# EAGLE design jamma (EAGLE 7.3.0)
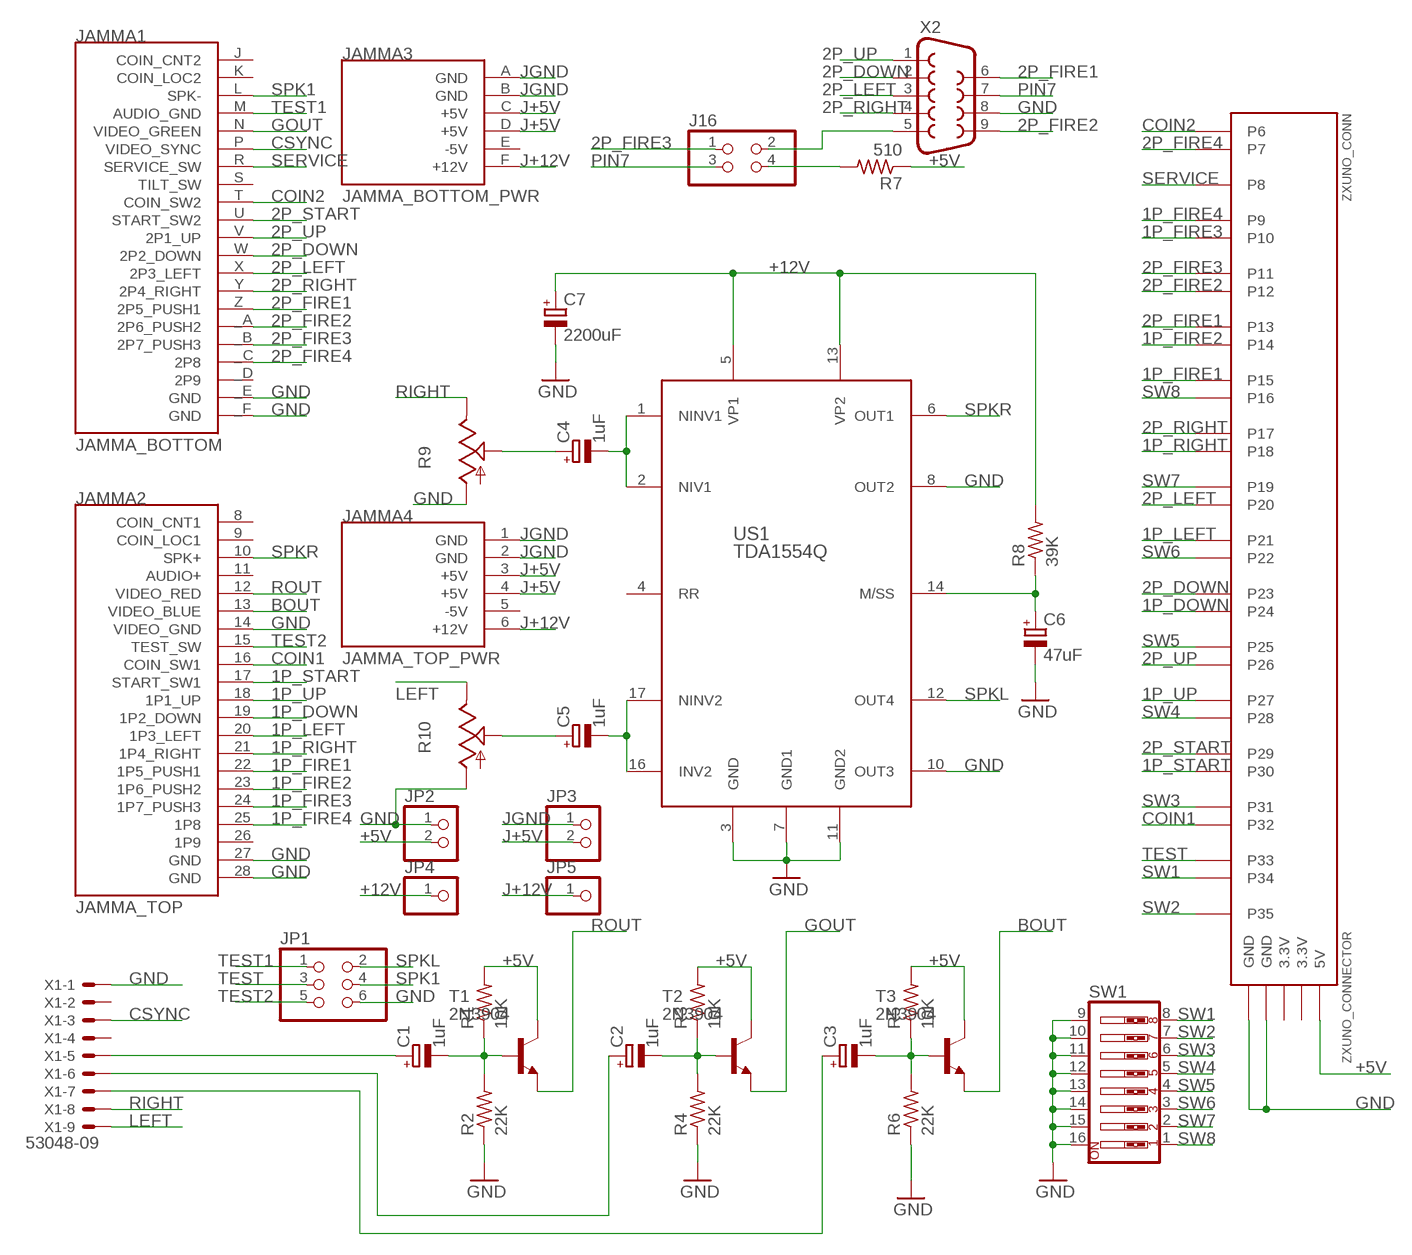
[diagram p0: schematic, sheet 1]

## Parts
C1  1uF  CPOL-EUE2-5  [E2-5]
C2  1uF  CPOL-EUE2-5  [E2-5]
C3  1uF  CPOL-EUE2-5  [E2-5]
C4  1uF  CPOL-EUE2-5  [E2-5]
C5  1uF  CPOL-EUE2-5  [E2-5]
C6  47uF  CPOL-EUE5-5  [E5-5]
C7  2200uF  CPOL-EUE5-10.5  [E5-10,5]
J16  PINHD-2X2  [2X02]
JAMMA1  JAMMA_BOTTOM  [JAMMA_BOTTOM]
JAMMA2  JAMMA_TOP  [JAMMA_TOP]
JAMMA3  JAMMA_BOTTOM_PWR  [JAMMA_BOTTOM_PWR]
JAMMA4  JAMMA_TOP_PWR  [JAMMA_TOP_PWR]
JP1  PINHD-2X3/90  [2X03/90]
JP2  PINHD-1X2  [1X02]
JP3  PINHD-1X2  [1X02]
JP4  PINHD-1X1  [1X01]
JP5  PINHD-1X1  [1X01]
R1  10K  R-US_0204/7  [0204/7]
R2  22K  R-US_0204/7  [0204/7]
R3  10K  R-US_0204/7  [0204/7]
R4  22K  R-US_0204/7  [0204/7]
R5  10K  R-US_0204/7  [0204/7]
R6  22K  R-US_0204/7  [0204/7]
R7  510  R-US_0204/7  [0204/7]
R8  39K  R-US_0204/7  [0204/7]
R9  TRIM_US-CA6V  [CA6V]
R10  TRIM_US-CA6V  [CA6V]
SW1  SW_DIP-8  [EDG-08]
T1  2N3904  [TO92]
T2  2N3904  [TO92]
T3  2N3904  [TO92]
US1  TDA1554Q  [SOT243-1]
X1  53048-09  [53048-09]
X2  DB9MALE  [DB9_MALE]
ZXUNO_CONN  ZXUNO_CONNECTOR  [ZXUNO_CONNECTOR]

## Nets
1P_DOWN: JAMMA2.19(1P2_DOWN) ZXUNO_CONN.P24
1P_FIRE1: JAMMA2.22(1P5_PUSH1) ZXUNO_CONN.P15
1P_FIRE2: JAMMA2.23(1P6_PUSH2) ZXUNO_CONN.P14
1P_FIRE3: JAMMA2.24(1P7_PUSH3) ZXUNO_CONN.P10
1P_FIRE4: JAMMA2.25(1P8) ZXUNO_CONN.P9
1P_LEFT: JAMMA2.20(1P3_LEFT) ZXUNO_CONN.P21
1P_RIGHT: JAMMA2.21(1P4_RIGHT) ZXUNO_CONN.P18
1P_START: JAMMA2.17(START_SW1) ZXUNO_CONN.P30
1P_UP: JAMMA2.18(1P1_UP) ZXUNO_CONN.P27
2P_DOWN: JAMMA1.W(2P2_DOWN) X2.2 ZXUNO_CONN.P23
2P_FIRE1: JAMMA1.Z(2P5_PUSH1) X2.6 ZXUNO_CONN.P13
2P_FIRE2: JAMMA1._A(2P6_PUSH2) X2.9 ZXUNO_CONN.P12
2P_FIRE3: J16.1 JAMMA1._B(2P7_PUSH3) ZXUNO_CONN.P11
2P_FIRE4: JAMMA1._C(2P8) ZXUNO_CONN.P7
2P_LEFT: JAMMA1.X(2P3_LEFT) X2.3 ZXUNO_CONN.P20
2P_RIGHT: JAMMA1.Y(2P4_RIGHT) X2.4 ZXUNO_CONN.P17
2P_START: JAMMA1.U(START_SW2) ZXUNO_CONN.P29
2P_UP: JAMMA1.V(2P1_UP) X2.1 ZXUNO_CONN.P26
+5V [power]: JP2.2 R1.2 R3.2 R5.2 R7.1 T1.1(C) T2.1(C) T3.1(C) ZXUNO_CONN.5V
+12V: C7.+ JP4.1 R8.2 US1.5(VP1) US1.13(VP2)
BIN: C3.+ X1.3
BOUT: JAMMA2.13(VIDEO_BLUE) T3.3(E)
COIN1: JAMMA2.16(COIN_SW1) ZXUNO_CONN.P32
COIN2: JAMMA1.T(COIN_SW2) ZXUNO_CONN.P6
CSYNC: JAMMA1.P(VIDEO_SYNC) X1.7
GIN: C2.+ X1.4
GND [power]: C6.- C7.- JAMMA1._E(GND) JAMMA1._F(GND) JAMMA2.14(VIDEO_GND) JAMMA2.27(GND) JAMMA2.28(GND) JP1.6 JP2.1 R2.1 R4.1 R6.1 R9.A R10.A SW1.9 SW1.10 SW1.11 SW1.12 SW1.13 SW1.14 SW1.15 SW1.16 US1.3(GND) US1.7(GND1) US1.8(OUT2) US1.10(OUT3) US1.11(GND2) X1.9 X2.8 ZXUNO_CONN.GND@1(GND) ZXUNO_CONN.GND@2(GND)
GOUT: JAMMA1.N(VIDEO_GREEN) T2.3(E)
J+5V [power]: JAMMA3.C(+5V) JAMMA3.D(+5V) JAMMA4.3(+5V) JAMMA4.4(+5V) JP3.2
J+12V: JAMMA3.F(+12V) JAMMA4.6(+12V) JP5.1
JGND [power]: JAMMA3.A(GND) JAMMA3.B(GND) JAMMA4.1(GND) JAMMA4.2(GND) JP3.1
LEFT: R10.E X1.1
N$1: C4.- US1.1(NINV1) US1.2(NIV1)
N$2: C5.- US1.16(INV2) US1.17(NINV2)
N$3: C5.+ R10.S
N$4: C1.- R1.1 R2.2 T1.2(B)
N$5: J16.2 X2.5
N$7: C6.+ R8.1 US1.14(M/SS)
N$8: C3.- R5.1 R6.2 T3.2(B)
N$9: C4.+ R9.S
N$11: C2.- R3.1 R4.2 T2.2(B)
N$15: J16.4 R7.2
PIN7: J16.3 X2.7
RIGHT: R9.E X1.2
RIN: C1.+ X1.5
ROUT: JAMMA2.12(VIDEO_RED) T1.3(E)
SERVICE: JAMMA1.R(SERVICE_SW) ZXUNO_CONN.P8
SPK1: JAMMA1.L(SPK-) JP1.4
SPKL: JP1.2 US1.12(OUT4)
SPKR: JAMMA2.10(SPK+) US1.6(OUT1)
SW1: SW1.8 ZXUNO_CONN.P34
SW2: SW1.7 ZXUNO_CONN.P35
SW3: SW1.6 ZXUNO_CONN.P31
SW4: SW1.5 ZXUNO_CONN.P28
SW5: SW1.4 ZXUNO_CONN.P25
SW6: SW1.3 ZXUNO_CONN.P22
SW7: SW1.2 ZXUNO_CONN.P19
SW8: SW1.1 ZXUNO_CONN.P16
TEST: JP1.3 ZXUNO_CONN.P33
TEST1: JAMMA1.M(AUDIO_GND) JP1.1
TEST2: JAMMA2.15(TEST_SW) JP1.5
Unconnected: JAMMA1._D(2P9) JAMMA1.J(COIN_CNT2) JAMMA1.K(COIN_LOC2) JAMMA1.S(TILT_SW) JAMMA2.8(COIN_CNT1) JAMMA2.9(COIN_LOC1) JAMMA2.11(AUDIO+) JAMMA2.26(1P9) US1.4(RR) X1.6 X1.8

## Power pins joined to a net without a drawn wire
3.3V: ZXUNO_CONN.3.3V@1(3.3V) ZXUNO_CONN.3.3V@2(3.3V)
-5V: JAMMA3.E(-5V) JAMMA4.5(-5V)

## Library data of the parts
C1-C7 = rcl:CPOL-EU: POLARIZED CAPACITOR, European symbol
J16 = pinhead:PINHD-2X2: PIN HEADER
JAMMA1 = JAMMA:JAMMA_BOTTOM: JAMMA Connector Bottom Solder side for these card-edge connenctors HIROSE CR7E-56DA-3.96E HIROSE CR7E-56DB-3.96E KEL 1168-056-009
JAMMA2 = JAMMA:JAMMA_TOP: JAMMA Connector Top Parts side for these card-edge connenctors HIROSE CR7E-56DA-3.96E HIROSE CR7E-56DB-3.96E KEL 1168-056-009
JAMMA3 = JAMMA_pwr:JAMMA_BOTTOM_PWR: JAMMA Connector Bottom Solder side for these card-edge connenctors HIROSE CR7E-56DA-3.96E HIROSE CR7E-56DB-3.96E KEL 1168-056-009
JAMMA4 = JAMMA_pwr:JAMMA_TOP_PWR: JAMMA Connector Top Parts side for these card-edge connenctors HIROSE CR7E-56DA-3.96E HIROSE CR7E-56DB-3.96E KEL 1168-056-009
JP1 = pinhead:PINHD-2X3: PIN HEADER
JP2 JP3 = pinhead:PINHD-1X2: PIN HEADER
JP4 JP5 = pinhead:PINHD-1X1: PIN HEADER
R1-R6 = adafruit:R-US_: RESISTOR, American symbol
R7 R8 = rcl:R-US_: RESISTOR, American symbol
R9 R10 = pot:TRIM_US-: POTENTIOMETER
SW1 = special:SW_DIP-8: DIP SWITCH
T1-T3 = transistor:2N3904: NPN TRANSISTOR
US1 = PowerAmplifier:TDA1554: The TDA1554Q is an integrated class-B output amplifier in a 17-lead single-in-line (SIL) plastic power package. The circuit contains 4 x 11 W single-ended or 2 x 22 W bridge amplifiers. The device is primarily developed for car radio applications.
X1 = con-molex:53?-09: CONNECTOR wire to board 1.25 mm (.049 inch) pitch header; MPN: 53048-0910; OC_FARNELL: 1012239; OC_NEWARK: 98K9837
X2 = SparkFun-Connectors:DB9: DB9 Connector Standard DB9 (D-Sub 9) serial connector. Can be used for CAN bus as well as RS485 and RS232. Footprint production proven. Spark Fun Electronics SKU : PRT-00429
ZXUNO_CONN = zxuno:ZXUNO_CONNECTOR

## Net classes
1 power: width 0.305 mm, clearance 0.178 mm to class 0, clearance 0.229 mm

## Board
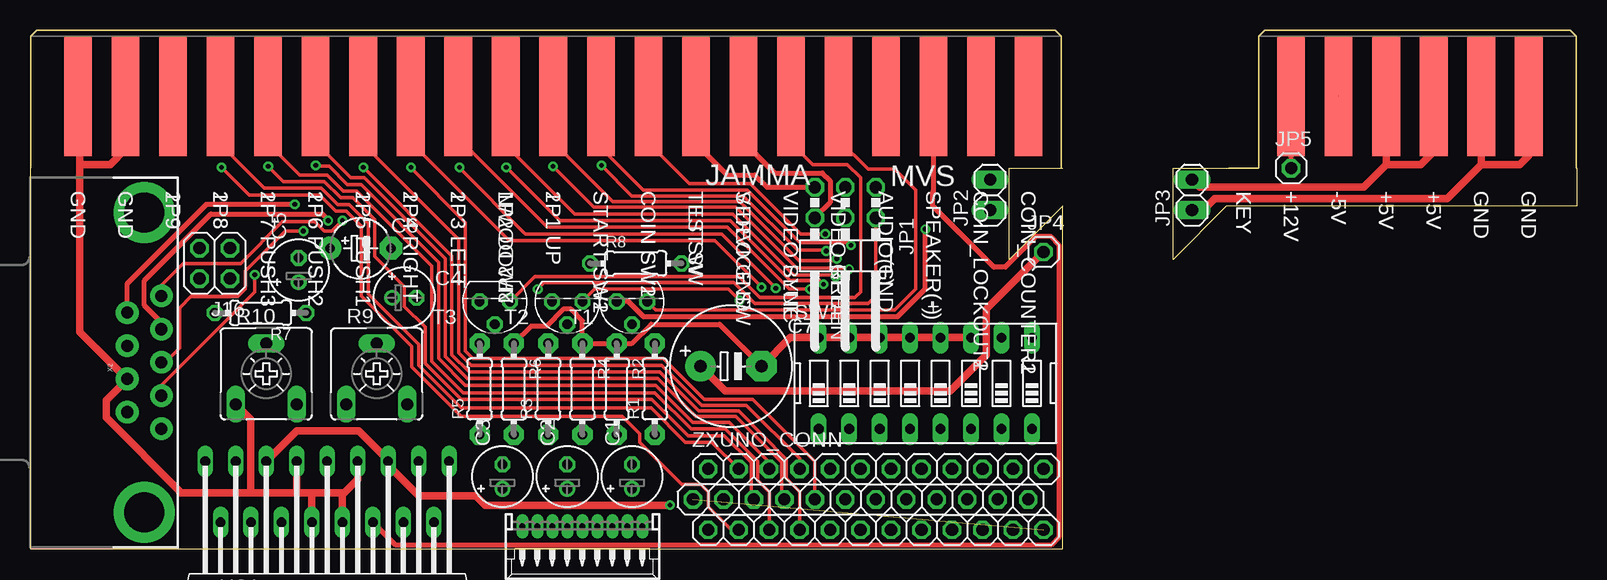
[diagram p1: board, top side]
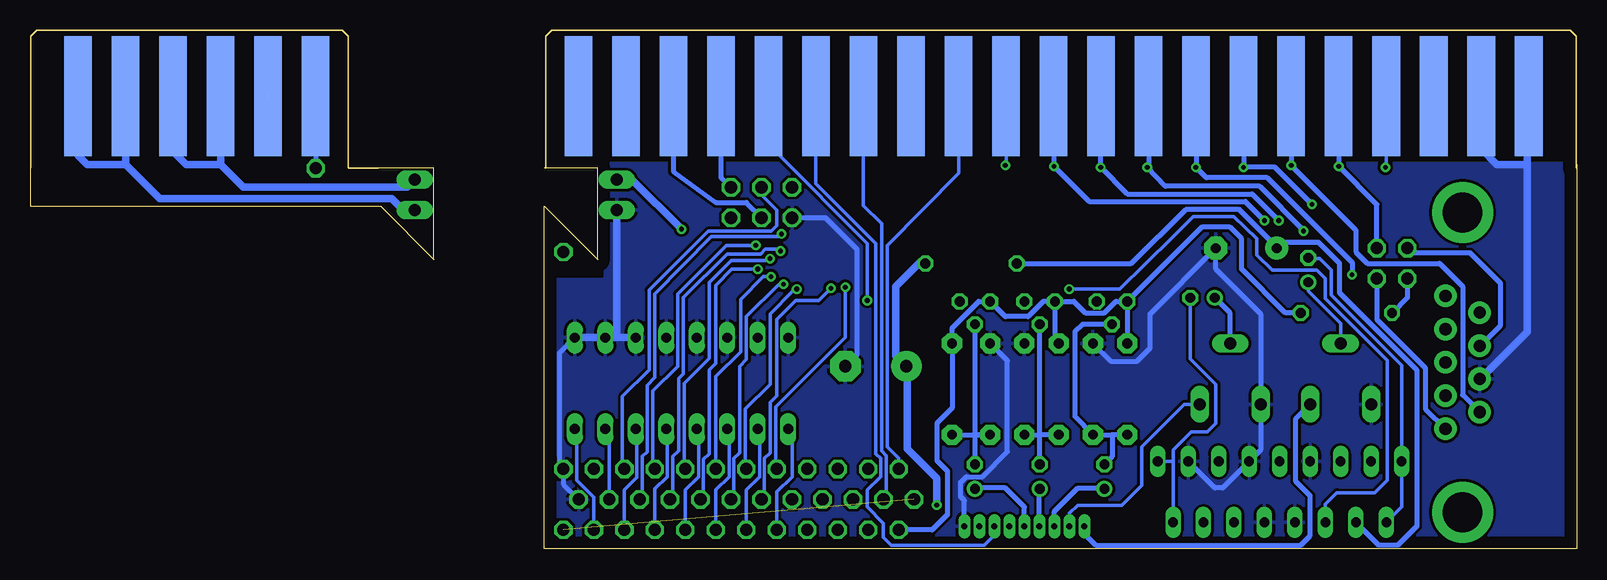
[diagram p2: board, bottom side, seen from below]

Size 128.91 x 43.28 mm. Coordinates in mm from the lower left corner, seen from the top.
Outline: 86.02,0 0,0 0,32.05
Outline: 86.04,0 86.04,28.57 81.6,24.13 81.6,31.75 86.04,31.75
Outline: 128.91,31.75 128.91,28.57 99.69,28.57 95.25,24.13 95.25,31.75 102.23,31.75
Copper layers (1*16): Top 0.035mm / dielectric 1.5mm / Bottom 0.035mm
Design rules "default": minimum track width 10mil, minimum drill 24mil, track to track 8mil, track to pad 8mil, pad to pad 8mil, via to via 8mil, smd to smd 8mil, copper to edge 40mil, drill to drill 8mil, minimum pad ring 10mil, minimum via ring 8mil, stop-mask expansion 4mil, vias tented up to drill 0mil, thermal gap 10mil

### Footprints (pad centres in the part's own frame; a part is rotated, then mirrored left to right if it is on the bottom)
E2-5 = drill 0.813 pad 1.27: + -1.016,0 | drill 0.813 pad 1.27 octagon: - 1.016,0
E5-5 = drill 0.813 pad 1.905: + -2.54,0 | drill 0.813 pad 1.905 octagon: - 2.54,0
E5-10,5 = drill 1.016 pad 2.54: + -2.54,0 | drill 1.016 pad 2.54 octagon: - 2.54,0
2X02 = drill 1.016 octagon: 1 -1.27,-1.27; 2 -1.27,1.27; 3 1.27,-1.27; 4 1.27,1.27
JAMMA_BOTTOM = smd 2.3 x 10 bottom: _A 33.66,0; _B 37.62,0; _C 41.58,0; _D 45.54,0; _E 49.5,0; _F 53.46,0; J -25.74,0; K -21.78,0; L -17.82,0; M -13.86,0; N -9.9,0; P -5.94,0; R -1.98,0; S 1.98,0; T 5.94,0; U 9.9,0; V 13.86,0; W 17.82,0; X 21.78,0; Y 25.74,0; Z 29.7,0
JAMMA_TOP = smd 2.3 x 10: 8 -25.74,0; 9 -21.78,0; 10 -17.82,0; 11 -13.86,0; 12 -9.9,0; 13 -5.94,0; 14 -1.98,0; 15 1.98,0; 16 5.94,0; 17 9.9,0; 18 13.86,0; 19 17.82,0; 20 21.78,0; 21 25.74,0; 22 29.7,0; 23 33.66,0; 24 37.62,0; 25 41.58,0; 26 45.54,0; 27 49.5,0; 28 53.46,0
JAMMA_BOTTOM_PWR = smd 2.3 x 10 bottom: A -10.28,0; B -6.32,0; C -2.36,0; D 1.6,0; E 5.56,0; F 9.52,0
JAMMA_TOP_PWR = smd 2.3 x 10: 1 -10.28,0; 2 -6.32,0; 3 -2.36,0; 4 1.6,0; 5 5.56,0; 6 9.52,0
2X03/90 = drill 1.016 octagon: 1 -2.54,-6.35; 2 -2.54,-3.81; 3 0,-6.35; 4 0,-3.81; 5 2.54,-6.35; 6 2.54,-3.81
1X02 = drill 1.016 long: 1 -1.27,0; 2 1.27,0
1X01 = drill 1.016 octagon: 1 0,0
0204/7 = drill 0.813 pad 1.676 octagon: 1 -3.81,0; 2 3.81,0
0204/7' = drill 0.813 octagon: 1 -3.81,0; 2 3.81,0
CA6V = drill 1.016 long: A -2.54,-2.54; E 2.54,-2.54; S 0,2.54
EDG-08 = drill 0.813 long: 1 -8.89,-3.81; 2 -6.35,-3.81; 3 -3.81,-3.81; 4 -1.27,-3.81; 5 1.27,-3.81; 6 3.81,-3.81; 7 6.35,-3.81; 8 8.89,-3.81; 9 8.89,3.81; 10 6.35,3.81; 11 3.81,3.81; 12 1.27,3.81; 13 -1.27,3.81; 14 -3.81,3.81; 15 -6.35,3.81; 16 -8.89,3.81
TO92 = drill 0.813 octagon: 1 1.27,0; 2 0,1.905; 3 -1.27,0
SOT243-1 = drill 0.8 long: 1 10.16,13.97; 2 8.89,8.89; 3 7.62,13.97; 4 6.35,8.89; 5 5.08,13.97; 6 3.81,8.89; 7 2.54,13.97; 8 1.27,8.89; 9 0,13.97; 10 -1.27,8.89; 11 -2.54,13.97; 12 -3.81,8.89; 13 -5.08,13.97; 14 -6.35,8.89; 15 -7.62,13.97; 16 -8.89,8.89; 17 -10.16,13.97
53048-09 = drill 0.5 pad 0.698 long: 1 5,-1.25; 2 3.75,-1.25; 3 2.5,-1.25; 4 1.25,-1.25; 5 0,-1.25; 6 -1.25,-1.25; 7 -2.5,-1.25; 8 -3.75,-1.25; 9 -5,-1.25
DB9_MALE = drill 1.016 pad 1.88: 1 5.54,-1.42; 2 2.77,-1.42; 3 0,-1.42; 4 -2.77,-1.42; 5 -5.54,-1.42; 6 4.15,1.42; 7 1.38,1.42; 8 -1.38,1.42; 9 -4.15,1.42 | drill 3.302 pad 5.08: G1 -12.5,0; G2 12.5,0
ZXUNO_CONNECTOR = drill 1.016 octagon: 3.3V@1 -13.97,0; 3.3V@2 15.24,-2.54; 5V -12.7,-2.54; GND@1 15.24,2.54; GND@2 13.97,0; NC@1 12.7,2.54; P6 -12.7,2.54; P7 -10.16,-2.54; P8 -11.43,0; P9 -10.16,2.54; P10 -7.62,-2.54; P11 -8.89,0; P12 -7.62,2.54; P13 -5.08,-2.54; P14 -6.35,0; P15 -5.08,2.54; P16 -2.54,-2.54; P17 -3.81,0; P18 -2.54,2.54; P19 0,-2.54; P20 -1.27,0; P21 0,2.54; P22 2.54,-2.54; P23 1.27,0; P24 2.54,2.54; P25 5.08,-2.54; P26 3.81,0; P27 5.08,2.54; P28 7.62,-2.54; P29 6.35,0; P30 7.62,2.54; P31 10.16,-2.54; P32 8.89,0; P33 10.16,2.54; P34 12.7,-2.54; P35 11.43,0

### Placement (x,y rotation side)
C1  50.16,6.03 90 top
C2  44.77,6.03 90 top
C3  39.37,6.03 90 top
C4  31.19,20.95 0 top
C5  22.38,23.26 90 top
C6  27.54,25.08 0 top
C7  58.42,15.24 0 top
J16  15.4,23.81 180 top
JAMMA1  57.47,37.78 180 top
JAMMA2  57.47,37.78 180 top
JAMMA3  114.62,37.78 180 top
JAMMA4  114.62,37.78 180 top
JP1  67.94,23.81 180 top
JP2  80.01,29.53 90 top
JP3  96.84,29.53 90 top
JP4  84.45,24.77 0 top
JP5  105.09,31.75 0 top
R1  52.07,13.34 90 top
R2  48.9,13.34 270 top
R3  43.18,13.34 90 top
R4  46.04,13.34 270 top
R5  37.47,13.34 90 top
R6  40.32,13.34 270 top
R7  510  [0204/7']  19.21,19.68 180 top
R8  39K  [0204/7']  50.48,23.81 0 top
R9  28.89,14.61 0 top
R10  19.68,14.61 0 top
SW1  74.61,13.81 0 top
T1  50.16,20.64 180 top
T2  44.77,20.64 180 top
T3  38.73,20.64 180 top
US1  24.77,-6.67 0 top
X1  46.04,0.64 180 top
X2  9.53,15.56 90 top
ZXUNO_CONN  69.22,4.13 0 top

### Tracks (layer width: path | path; a pad name or v marks a point on that pad's centre or on a via)
1P_DOWN  (via drill 0.4)
  Top 0.305: JAMMA2.19 39.65,33.7 45.4,27.94 58.58,27.94 63.66,22.86 66.99,22.86 v67.15,22.7
  Bottom 0.305: v67.15,22.7 67.79,22.7 69.69,20.8 69.69,16.43 71.75,14.37 ZXUNO_CONN.P24
1P_FIRE1
  Top 0.305: JAMMA2.22 27.77,33.75 35.72,25.8 35.72,16.35 36.75,15.32 52.63,15.32 55.96,11.99 59.69,11.99 64.14,7.54 ZXUNO_CONN.P15
1P_FIRE2
  Top 0.305: JAMMA2.23 23.81,33.9 26.75,30.96 27.86,30.96 34.61,24.21 34.61,16.03 36.43,14.21 52.31,14.21 55.48,11.03 58.82,11.03 62.63,7.22 62.63,4.37 ZXUNO_CONN.P14
1P_FIRE3
  Top 0.305: JAMMA2.24 19.85,33.81 22.46,31.19 24.77,31.19 26.11,29.84 27.23,29.84 33.5,23.57 33.5,15.64 36.12,13.02 52.07,13.02 55.09,10 57.94,10 60.64,7.3 60.64,5.71 61.59,4.76 ZXUNO_CONN.P10
1P_FIRE4
  Top 0.305: JAMMA2.25 15.89,33.72 19.53,30.08 24.29,30.08 25.64,28.73 26.59,28.73 28.18,27.15 28.18,21.27 32.38,17.07 32.38,15.32 35.96,11.75 51.75,11.75 54.61,8.89 56.83,8.89 ZXUNO_CONN.P9
1P_LEFT  (via drill 0.4)
  Top 0.305: JAMMA2.20 35.69,34.24 43.1,26.83 58.1,26.83 63.26,21.67 v65.01,21.67
  Bottom 0.305: v65.01,21.67 65.33,21.51 67.23,19.61 67.23,13.73 69.29,11.67 69.29,6.75 ZXUNO_CONN.P21
1P_RIGHT  (via drill 0.4)
  Top 0.305: JAMMA2.21 31.73,33.92 39.93,25.72 57.07,25.72 v60.96,21.83
  Bottom 0.305: v60.96,21.83 60.96,17.62 66.75,11.83 66.75,6.75 ZXUNO_CONN.P18
1P_START  (via drill 0.4)
  Top 0.305: JAMMA2.17 47.57,33.47 51.12,29.92 59.77,29.92 64.14,25.56 68.18,25.56 v68.42,25.32
  Bottom 0.305: v68.42,25.32 70.88,25.32 74.93,21.27 74.93,15.24 76.99,13.18 76.99,6.83 ZXUNO_CONN.P30
1P_UP  (via drill 0.4)
  Top 0.305: JAMMA2.18 43.61,33.94 48.58,28.97 59.13,28.97 64.06,24.05 67.07,24.05 v67.23,24.21
  Bottom 0.305: v67.23,24.21 67.39,24.05 70.48,24.05 72.31,22.23 72.31,15.88 74.37,13.81 74.37,6.75 ZXUNO_CONN.P27
2P_DOWN  (via drill 0.4)
  Top 0.305: v39.69,31.83 44.13,27.38 58.34,27.38 63.34,22.38 65.8,22.38 v66.12,22.07
  Top 0.406: X2.2 10.95,18.9 9.53,20.32 9.53,22.38 15.08,27.94 24.37,27.94 v24.84,27.38
  Bottom 0.305: v66.12,22.07 66.52,22.07 69.22,19.37 69.22,15.8 69.77,15.24 69.77,8.02 70.25,7.54 70.25,4.37 ZXUNO_CONN.P23
  Bottom 0.406: JAMMA1.W 39.69,37.74 v39.69,31.83 37.47,29.61 27.07,29.61 v24.84,27.38
2P_FIRE1  (via drill 0.4)
  Top 0.305: v27.78,31.83 35.16,24.45 35.16,16.19 36.59,14.76 52.47,14.76 55.72,11.51 59.05,11.51 63.02,7.46 63.02,5.87 64.14,4.76 ZXUNO_CONN.P13
  Top 0.406: X2.6 8.11,22.15 14.68,28.73 v22.07,28.73
  Bottom 0.406: JAMMA1.Z 27.77,31.84 v27.78,31.83 25.16,31.83 v22.07,28.73
2P_FIRE2  (via drill 0.4)
  Top 0.305: v23.81,31.98 23.81,31.91 24.92,31.91 26.43,30.4 27.62,30.4 34.05,23.89 34.05,15.88 36.27,13.65 52.15,13.65 55.24,10.56 58.26,10.56 61.59,7.22 ZXUNO_CONN.P12
  Bottom 0.406: JAMMA1._A v23.81,31.98 18.41,26.59 18.41,24.77 17.46,23.81 11.43,23.81 9.53,21.91 9.53,12.83 X2.9
2P_FIRE3  (via drill 0.4)
  Top 0.305: v19.85,31.91 21.11,30.64 24.53,30.64 25.88,29.29 26.91,29.29 28.73,27.46 28.73,24.37 31.19,21.91 31.19,20.24 32.94,18.49 32.94,15.48 35.96,12.46 51.83,12.46 54.85,9.45 57.86,9.45 60.09,7.22 60.09,4.37 ZXUNO_CONN.P11
  Bottom 0.406: JAMMA1._B v19.85,31.91 16.67,28.73 J16.1
2P_FIRE4  (via drill 0.4)
  Top 0.305: ZXUNO_CONN.P7 58.42,1.59 56.52,3.49 56.52,4.76 55.88,5.4 54.29,5.4 50.8,8.89 50.8,9.6 49.37,11.03 35.96,11.03 31.83,15.16 31.83,16.91 27.62,21.11 27.62,26.91 26.35,28.18 25.48,28.18 24.13,29.53 18.26,29.53 v15.95,31.83
  Bottom 0.305: JAMMA1._C 15.89,31.9 v15.95,31.83
2P_LEFT  (via drill 0.4)
  Top 0.305: v35.8,31.83 35.8,31.75 41.27,26.27 57.63,26.27 v62.15,21.75 | X2.3 11.27,15.56 12.46,16.75 12.46,20.08 13.41,21.03 17.3,21.03 17.94,21.67 17.94,23.18 21.27,26.51 v22.78,26.51
  Bottom 0.305: v62.15,21.75 63.18,20.72 65.09,20.72 66.67,19.13 66.67,12.78 67.23,12.22 67.23,8.02 67.71,7.54 67.71,4.37 ZXUNO_CONN.P20
  Bottom 0.406: JAMMA1.X 35.69,31.94 v35.8,31.83 34.29,30.24 26.43,30.24 22.78,26.59 v22.78,26.51
2P_RIGHT  (via drill 0.4)
  Top 0.305: v31.75,31.83 31.75,31.75 36.27,27.23 36.27,16.51 36.91,15.88 52.78,15.88 56.2,12.46 60.25,12.46 65.41,7.3 ZXUNO_CONN.P17 | X2.4 10.95,13.64 18.73,21.43 v18.73,22.86
  Bottom 0.406: JAMMA1.Y 31.73,31.85 v31.75,31.83 30.88,30.96 25.8,30.96 18.73,23.89 v18.73,22.86
2P_START  (via drill 0.4)
  Top 0.305: v47.62,31.99 50.16,29.45 59.45,29.45 63.98,24.92 66.28,24.92 v66.36,24.84
  Bottom 0.305: JAMMA1.U 47.57,32.05 v47.62,31.99 | ZXUNO_CONN.P29 75.33,4.37 75.33,7.7 74.85,8.18 74.85,14.21 74.45,14.61 74.45,20.95 70.8,24.61 68.02,24.61 67.63,25 66.52,25 v66.36,24.84
2P_UP  (via drill 0.4)
  Top 0.305: v43.58,31.91 46.99,28.5 58.82,28.5 63.9,23.42 68.18,23.42 v68.26,23.34 | X2.1 10.95,21.98 12.78,23.81 17.54,23.81 21.03,27.3 23.73,27.3 24.53,26.51 25.16,26.51 v26.04,27.38
  Bottom 0.305: v68.26,23.34 70.41,23.34 71.75,21.99 71.75,15.48 72.31,14.92 72.31,7.94 72.79,7.46 72.79,4.37 ZXUNO_CONN.P26
  Bottom 0.406: JAMMA1.V 43.61,31.94 v43.58,31.91 40.64,28.97 27.62,28.97 v26.04,27.38
3.3V  (1 unrouted)
+5V  (via drill 0.4)
  Top 0.406: T1.1 49.85,20.64 51.12,19.37 72.31,19.37 74.61,21.67 v74.61,26.67
  Bottom 0.406: T2.1 43.5,17.46 R3.2 | T3.1 R5.2 | T2.1 41.91,20.64 40.96,19.68 39.37,19.68 38.42,20.64 T3.1 | T2.1 44.45,20.64 45.72,19.37 47.62,19.37 T1.1 49.85,20.64 52.07,18.41 R1.2 52.07,11.75 53.34,10.48 53.34,7.38 52.47,6.51 52.47,2.86 53.74,1.59 ZXUNO_CONN.5V | T3.1 31.27,26.83 28.89,26.83 27.94,25.88 27.94,23.34 24.29,19.68 R7.1
  Bottom 0.61: JP2.2 78.74,30.8 v74.61,26.67
+12V  (via drill 0.4)
  Top 0.61: JP4.1 79.69,20 79.69,16.19 76.68,13.18 57.94,13.18 C7.+ | v53.34,3.65 37.94,3.65 37.15,4.45 32.38,4.45 29.84,6.99 US1.5 29.69,7.54 27.38,9.84 22.23,9.84 US1.13
  Bottom 0.61: R8.2 54.85,23.81 56.75,21.91 56.75,16.11 C7.+ 55.8,15.16 55.8,8.33 53.34,5.87 v53.34,3.65
-5V  (1 unrouted)
BIN
  Bottom 0.406: X1.3 43.54,3.13 41.59,5.08 39.43,5.08 C3.+
BOUT
  Top 0.305: JAMMA2.13 63.41,33.91 65.25,32.07 68.1,32.07 69.22,30.96 69.22,21.43 68.74,20.95 60.8,20.95 59.05,22.7 42.07,22.7 T3.3
COIN1  (via drill 0.4)
  Top 0.305: JAMMA2.16 51.53,33.88 54.93,30.48 60.01,30.48 64.21,26.27 v66.28,26.27
  Bottom 0.305: ZXUNO_CONN.P32 77.87,4.37 77.87,7.7 77.47,8.1 77.47,13.65 76.83,14.29 76.83,21.27 72.15,26.04 66.52,26.04 v66.28,26.27
COIN2
  Bottom 0.305: JAMMA1.T 51.53,31.34 57.47,25.32 57.47,8.49 56.52,7.54 ZXUNO_CONN.P6
CSYNC
  Bottom 0.305: JAMMA1.P 63.41,30.47 58.42,25.48 58.42,7.94 58.02,7.54 58.02,6.03 59.13,4.92 59.13,3.49 57.78,2.14 57.78,0.95 57.15,0.32 49.37,0.32 48.58,1.11 48.58,1.84 X1.7
GIN
  Bottom 0.406: X1.4 44.79,5 C2.+
GND
  Top 0.406: C7.- 57.47,18.73 51.75,18.73 50.16,17.14 R2.1 R4.1 46.04,19.05 45.09,20 44.45,20 43.02,18.57 41.75,18.57 R6.1 | X2.8 8.11,14.14 | JAMMA2.14 59.45,33.98 62.07,31.35 66.04,31.35 66.67,30.72 66.67,28.89 JP1.6
  Top 0.61: X2.8 8.05,14.18 4.13,18.1 4.13,32.07 | 4.13,32.07 4.13,37.66 JAMMA2.28 | JAMMA2.27 7.97,33.37 6.67,32.07 4.13,32.07 | SW1.11 SW1.12 SW1.13 SW1.14 SW1.15 SW1.16 63.34,17.62 C7.- | 25.96,4.68 26.19,4.68 27.3,5.79 US1.7 | 25.96,4.68 23.57,4.68 | 23.57,4.68 22.38,4.68 | 22.38,4.68 18.41,4.68 | 18.41,4.68 12.62,4.68 | 12.62,4.68 12.46,4.68 | 8.11,14.14 6.35,12.38 6.35,10.95 12.62,4.68 | US1.8 26.04,4.6 25.96,4.68 | US1.11 22.23,4.84 22.38,4.68 | US1.10 23.5,4.6 23.57,4.68 | R10.A 18.41,10.79 18.41,4.68
  Bottom 0.406: ZXUNO_CONN.GND@2 84.45,5.4 ZXUNO_CONN.GND@1 84.77,6.99 84.77,16.35 SW1.9 | 65.41,17.94 SW1.16 | JP1.6 62.63,27.62 60.01,25 60.01,16.19 C7.- | X1.9 51.04,4.05 51.36,4.37 51.36,5.56 50.88,6.03 49.53,6.03 47.47,8.1 47.47,15.72 R2.1 | R6.1 38.81,15.64 36.67,15.64 35.56,16.75 35.56,19.61 C6.- 30.08,23.34 26.35,19.61 R9.A 26.35,8.26 US1.7 29.53,5.08 30.16,5.08 US1.3
  Bottom 0.61: JAMMA2.27 7.97,33.37 6.67,32.07 4.13,32.07 | JP2.1 80.01,17.7 80.09,17.62 | 80.09,17.62 SW1.10 SW1.9 | 80.09,17.62 SW1.11 | X2.8 8.05,14.18 4.13,18.1 4.13,32.07 | 4.13,32.07 4.13,37.66 JAMMA2.28
  pour Bottom: 0.4,32.15 80.96,32.15 80.96,22.46 85.72,22.46 85.72,0.48 0.4,0.48
GOUT  (via drill 0.4)
  Top 0.305: v59.13,20.72 58.18,21.67 47.07,21.67 T2.3
  Bottom 0.305: 67.37,33.08 66.73,33.08 59.13,25.48 v59.13,20.72
  Bottom 0.406: JAMMA1.N 67.37,33.08
J+5V
  Top 0.61: JAMMA4.4 113.02,32.05 | 113.02,32.05 111.12,30.16 97.47,30.16 JP3.2 | JAMMA4.3 116.98,33.16 115.89,32.07 113.03,32.07 113.02,32.05
  Bottom 0.61: JAMMA4.4 113.02,32.05 | 113.02,32.05 112.87,31.91 111.12,30.16 97.47,30.16 JP3.2 | JAMMA4.3 116.98,33.16 115.89,32.07 113.03,32.07 113.02,32.05
J+12V
  Top 0.406: JP5.1 JAMMA4.6
  Bottom 0.406: JAMMA4.6 105.1,31.44 JP5.1
JGND
  Top 0.61: JAMMA4.2 120.94,32.04 | 120.94,32.04 118.11,29.21 98.74,29.21 97.79,28.26 JP3.1 | JAMMA4.1 124.9,32.82 124.14,32.07 120.97,32.07 120.94,32.04
  Bottom 0.61: JAMMA4.2 120.94,32.07 | 120.94,32.07 120.94,32.04 118.11,29.21 98.74,29.21 97.79,28.26 JP3.1 | 120.94,32.07 124.14,32.07 124.9,32.82 JAMMA4.1
LEFT
  Bottom 0.406: X1.1 41.04,1.27 40.08,0.32 23.02,0.32 22.23,1.11 22.23,4.45 23.42,5.64 23.42,10.87 R10.E
N$1
  Bottom 0.305: C4.- 32.21,15.86 30.08,13.73 30.08,10.48 30.8,9.76 32.15,9.76 33.66,8.26 33.66,7.22 | 33.66,7.22 US1.2 | US1.1 33.73,7.3 33.66,7.22
N$2
  Bottom 0.305: C5.- 22.32,24.21 21.43,24.21 20.48,23.26 20.48,21.19 14.61,15.32 US1.17 14.61,3.49 US1.16
N$3
  Bottom 0.305: R10.S 19.68,18.81 22.38,21.51 C5.+
N$4
  Bottom 0.406: T1.2 50.16,9.53 | 50.16,9.53 C1.- | 50.16,9.53 R2.2 R1.1
N$5
  Bottom 0.406: J16.2 16.67,19.13 12.62,15.08 12.62,11.69 X2.5
N$7
  Bottom 0.406: US1.14 16.51,0.32 14.92,0.32 13.34,1.91 13.34,14.92 19.76,21.35 19.76,23.81 21.51,25.56 24.53,25.56 C6.+ 25,25.16 28.18,28.34 32.54,28.34 37.15,23.81 R8.1
N$8
  Bottom 0.406: 38.73,9.53 38.73,7.68 C3.- | 38.73,9.53 R6.2 41.83,11.03 41.83,18.1 41.2,18.73 T3.2 | R5.1 38.73,9.53
N$9
  Bottom 0.406: R9.S 28.89,19.67 C4.+
N$11
  Bottom 0.406: C2.- 44.77,9.53 | 44.77,9.53 T2.2 | R4.2 44.77,9.53 | R3.1 44.77,9.53
N$15
  Bottom 0.406: J16.4 14.13,20.95 R7.2
PIN7
  Bottom 0.406: X2.7 8.07,16.94 6.35,18.65 6.35,22.15 8.89,24.69 13.73,24.69 J16.3
RIGHT
  Bottom 0.305: X1.2 42.29,2.96 41.59,3.65 37.94,3.65 36.27,5.32 36.27,8.49 32.7,12.06 R9.E
RIN
  Bottom 0.406: X1.5 46.04,3.49 47.62,5.08 50.1,5.08 C1.+
ROUT
  Top 0.305: T1.3 52.15,19.92 72.07,19.92 73.82,21.67 73.82,29.92 72.07,31.67 69.85,31.67 67.37,34.15 JAMMA2.12
SERVICE
  Bottom 0.305: JAMMA1.R 59.45,28.65 57.94,27.15 57.94,8.18 57.55,7.78 57.55,4.37 ZXUNO_CONN.P8
SPK1
  Bottom 0.406: JAMMA1.L 75.29,31.47 71.75,28.89 69.22,28.89 JP1.4
SPKL  (via drill 0.4)
  Top 0.305: JP1.2 70.48,21.11 69.85,20.48 60.4,20.48 58.66,22.23 42.86,22.23 v42.31,21.67
  Bottom 0.305: v42.31,21.67 38.1,21.67 33.73,25.96 31.99,27.7 28.57,27.7 26.67,25.88 26.67,24.53 25.4,23.26 21.67,23.26 20.95,22.54 20.95,20.88 15.8,15.72 15.8,5.71 16.83,4.68 20,4.68 20.95,3.73 US1.12
SPKR
  Top 0.406: JAMMA2.10 75.29,29.8 75.25,29.77 75.25,28.57 80.33,23.5 81.28,23.5 83.82,26.04 85.09,26.04 85.72,25.4 85.72,0.95 85.09,0.32 30.48,0.32 US1.6
SW1
  Bottom 0.305: ZXUNO_CONN.P34 81.92,4.29 83.34,5.71 83.34,9.84 SW1.8
SW2
  Bottom 0.305: ZXUNO_CONN.P35 80.64,9.68 SW1.7
SW3
  Bottom 0.305: ZXUNO_CONN.P31 79.38,4.92 78.34,5.95 78.34,9.92 SW1.6
SW4
  Bottom 0.305: ZXUNO_CONN.P28 76.83,5 75.8,6.03 75.8,9.92 SW1.5
SW5
  Bottom 0.305: ZXUNO_CONN.P25 74.3,4.92 73.18,6.03 73.18,9.84 SW1.4
SW6
  Bottom 0.305: ZXUNO_CONN.P22 71.75,4.92 70.64,6.03 70.64,9.84 SW1.3
SW7
  Bottom 0.305: ZXUNO_CONN.P19 69.22,4.92 68.1,6.03 68.1,9.84 SW1.2
SW8
  Bottom 0.305: ZXUNO_CONN.P16 66.67,4.76 65.41,6.03 65.41,9.6 SW1.1
TEST
  Bottom 0.305: JP1.3 67.94,29.53 66.67,28.26 66.67,26.99 67.15,26.51 72.39,26.51 77.31,21.59 77.31,14.92 79.53,12.7 79.53,6.83 ZXUNO_CONN.P33
TEST1
  Bottom 0.406: JAMMA1.M 71.33,31 JP1.1
TEST2
  Top 0.406: JAMMA2.15 55.49,33.81 58.1,31.19 60.4,31.19 61.44,30.16 JP1.5

### Text on the board
tNames: JAMMA | MVS